# Altium schematic sheet BMI088.SchDoc
size A4
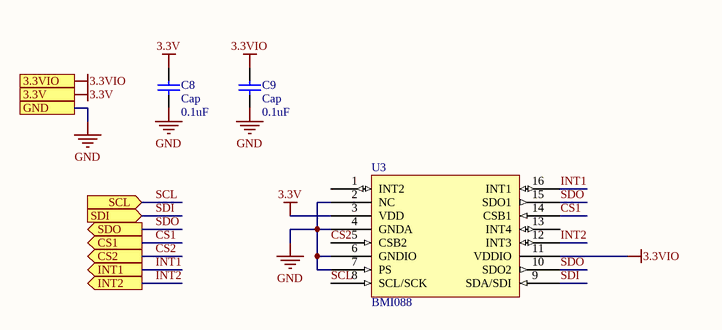
[diagram p0: BMI088.SchDoc]

## Parts
C8  Cap  value 0.1uF  [0603]
C9  Cap  value 0.1uF  [0603]
U3  BMI088  [BMI088]

## Ports
3.3V, 3.3VIO, CS1 (out), CS2 (out), GND, INT1 (out), INT2 (out), SCL (in), SDI (in), SDO (out)

## Nets
3.3V: C8.1 U3.3(VDD) ; port 3.3V
3.3VIO: C9.1 U3.11(VDDIO) ; port 3.3VIO
GND: C8.2 C9.2 U3.2(NC) U3.4(GNDA) U3.6(GNDIO) U3.7(PS) ; port GND
CS1: U3.14(CSB1) ; port CS1
CS2: U3.5(CSB2) ; port CS2
INT1: U3.16(INT1) ; port INT1
INT2: U3.12(INT3) ; port INT2
SCL: U3.8(SCL/SCK) ; port SCL
SDI: U3.9(SDA/SDI) ; port SDI
SDO: U3.10(SDO2) U3.15(SDO1) ; port SDO

Not connected (* = marked no-connect by the designer): U3 1(INT2) 13(INT4)

## Library data of the parts
C8 C9 = Cap: Capacitor; Published: 8-Jun-2000; LatestRevisionDate: 17-Jul-2002; LatestRevisionNote: Re-released for DXP Platform.; PackageReference: RAD-0.3; Publisher: Altium Limited; PackageDescription: Radial Cap, Thru-Hole; 2 Leads; 0.3 in Pin Spacing